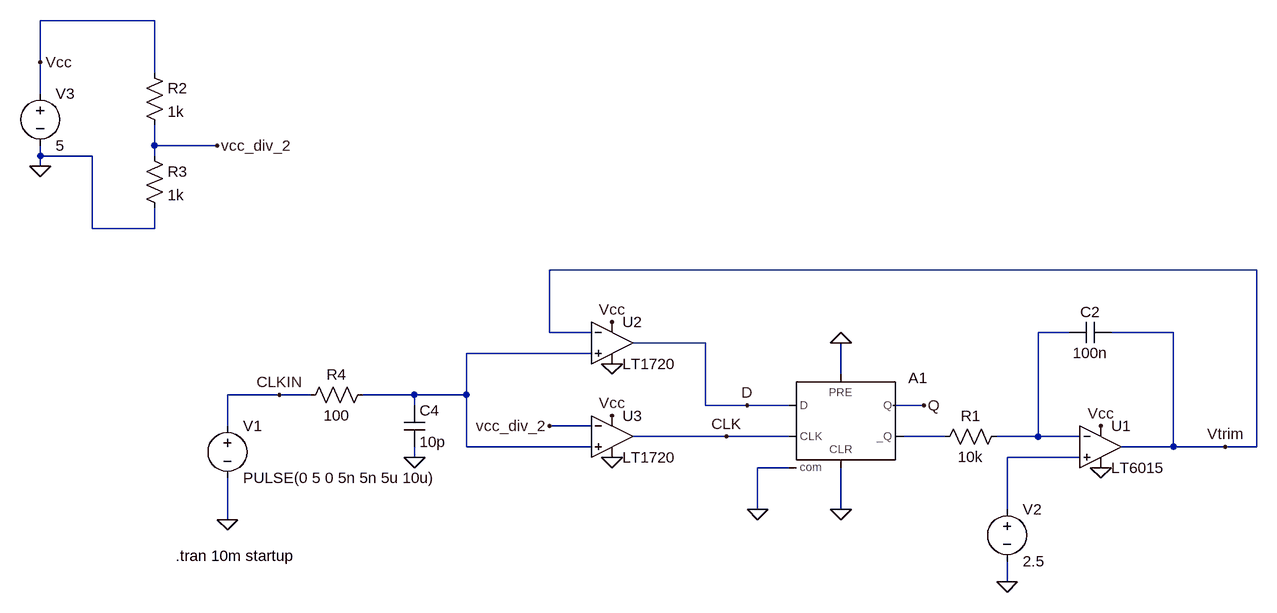
[diagram p0: schematic flip_flop_metastabilizer_comparators.asc]
flip_flop_metastabilizer_comparators.asc, the LTspice schematic file:
Version 4
SHEET 1 2312 680
WIRE 64 -816 -112 -816
WIRE -112 -752 -112 -816
WIRE 64 -736 64 -816
WIRE -112 -704 -112 -752
WIRE 64 -624 64 -656
WIRE 160 -624 64 -624
WIRE -112 -608 -112 -624
WIRE -32 -608 -112 -608
WIRE 64 -608 64 -624
WIRE -112 -592 -112 -608
WIRE -32 -496 -32 -608
WIRE 64 -496 64 -528
WIRE 64 -496 -32 -496
WIRE 1760 -432 672 -432
WIRE 672 -336 672 -432
WIRE 736 -336 672 -336
WIRE 1472 -336 1424 -336
WIRE 1632 -336 1536 -336
WIRE 912 -320 800 -320
WIRE 736 -304 544 -304
WIRE 1120 -272 1120 -320
WIRE 256 -240 176 -240
WIRE 304 -240 256 -240
WIRE 464 -240 384 -240
WIRE 544 -240 544 -304
WIRE 544 -240 464 -240
WIRE 464 -224 464 -240
WIRE 912 -224 912 -320
WIRE 976 -224 912 -224
WIRE 1040 -224 976 -224
WIRE 1248 -224 1200 -224
WIRE 176 -192 176 -240
WIRE 736 -192 672 -192
WIRE 944 -176 800 -176
WIRE 1040 -176 944 -176
WIRE 1280 -176 1216 -176
WIRE 1424 -176 1424 -336
WIRE 1424 -176 1360 -176
WIRE 1488 -176 1424 -176
WIRE 544 -160 544 -240
WIRE 736 -160 544 -160
WIRE 1632 -160 1632 -336
WIRE 1632 -160 1552 -160
WIRE 1712 -160 1632 -160
WIRE 1760 -160 1760 -432
WIRE 1760 -160 1712 -160
WIRE 464 -144 464 -160
WIRE 1488 -144 1376 -144
WIRE 1040 -128 992 -128
WIRE 992 -64 992 -128
WIRE 1120 -64 1120 -128
WIRE 1376 -64 1376 -144
WIRE 176 -48 176 -112
WIRE 1376 48 1376 16
FLAG 992 -64 0
FLAG 1120 -320 0
FLAG 176 -48 0
FLAG 256 -240 CLKIN
FLAG 944 -176 CLK
FLAG 976 -224 D
FLAG 1248 -224 Q
FLAG 1120 -64 0
FLAG -112 -592 0
FLAG -112 -752 Vcc
FLAG 768 -352 Vcc
FLAG 1520 -192 Vcc
FLAG 768 -208 Vcc
FLAG 768 -288 0
FLAG 768 -144 0
FLAG 1520 -128 0
FLAG 160 -624 vcc_div_2
FLAG 672 -192 vcc_div_2
FLAG 464 -144 0
FLAG 1376 48 0
FLAG 1712 -160 Vtrim
SYMBOL Digital\\dflop 1120 -272 R0
SYMATTR InstName A1
SYMATTR SpiceLine Vhigh 5 Trise 1u Tfall 1u TRISE 4n TD 12n REF 2.5
SYMATTR SpiceLine2 rhigh 1 rlow 1
SYMBOL voltage 176 -208 R0
WINDOW 123 0 0 Left 0
WINDOW 39 0 0 Left 0
SYMATTR InstName V1
SYMATTR Value PULSE(0 5 0 5n 5n 5u 10u)
SYMBOL OpAmps\\LT6015 1520 -160 R0
SYMATTR InstName U1
SYMBOL Comparators\\LT1720 768 -384 R0
SYMATTR InstName U2
SYMBOL Comparators\\LT1720 768 -240 R0
SYMATTR InstName U3
SYMBOL voltage -112 -720 R0
WINDOW 123 0 0 Left 0
WINDOW 39 0 0 Left 0
SYMATTR InstName V3
SYMATTR Value 5
SYMBOL res 1376 -192 R90
WINDOW 0 0 56 VBottom 2
WINDOW 3 32 56 VTop 2
SYMATTR InstName R1
SYMATTR Value 10k
SYMBOL cap 1536 -352 R90
WINDOW 0 0 32 VBottom 2
WINDOW 3 32 32 VTop 2
SYMATTR InstName C2
SYMATTR Value 100n
SYMBOL res 48 -752 R0
SYMATTR InstName R2
SYMATTR Value 1k
SYMBOL res 48 -624 R0
SYMATTR InstName R3
SYMATTR Value 1k
SYMBOL res 400 -256 R90
WINDOW 0 0 56 VBottom 2
WINDOW 3 32 56 VTop 2
SYMATTR InstName R4
SYMATTR Value 100
SYMBOL cap 448 -224 R0
SYMATTR InstName C4
SYMATTR Value 10p
SYMBOL voltage 1376 -80 R0
WINDOW 123 0 0 Left 0
WINDOW 39 0 0 Left 0
SYMATTR InstName V2
SYMATTR Value 2.5
TEXT 96 8 Left 2 !.tran 10m startup

The netlist it stands for:
* flip_flop_metastabilizer_comparators.asc
A1 D 0 CLK 0 0 N003 Q 0 DFLOP Vhigh 5 Trise 1u Tfall 1u TRISE 4n TD 12n REF 2.5 rhigh 1 rlow 1
V1 CLKIN 0 PULSE(0 5 0 5n 5n 5u 10u)
XU1 N004 N001 Vcc 0 Vtrim LT6016  ; LT6015, pins In+ In- V+ V- OUT
XU2 N002 Vtrim Vcc 0 D LT1720  ; pins In+ In- V+ V- OUT
XU3 N002 vcc_div_2 Vcc 0 CLK LT1720  ; pins In+ In- V+ V- OUT
V3 Vcc 0 5
R1 N001 N003 10k
C2 Vtrim N001 100n
R2 Vcc vcc_div_2 1k
R3 vcc_div_2 0 1k
R4 N002 CLKIN 100
C4 N002 0 10p
V2 N004 0 2.5
.tran 10m startup
.lib LTC2.lib
.lib LT1720.sub
.backanno
.end